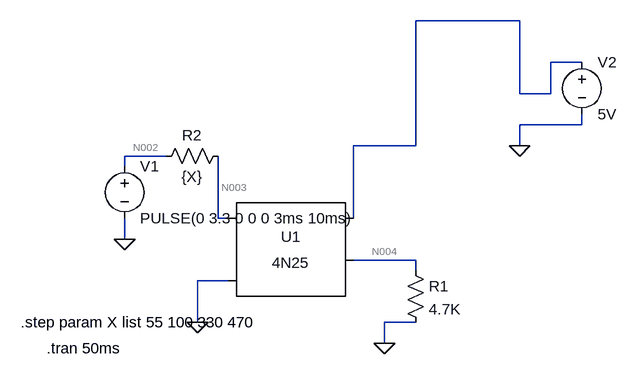
[diagram p0: schematic Draft1.asc]
Draft1.asc, the LTspice schematic file:
Version 4
SHEET 1 880 680
WIRE 512 -160 352 -160
WIRE 608 -96 560 -96
WIRE 512 -48 512 -160
WIRE 560 -48 560 -96
WIRE 560 -48 512 -48
WIRE 608 0 608 -16
WIRE 608 0 512 0
WIRE 352 32 352 -160
WIRE 352 32 256 32
WIRE 512 32 512 0
WIRE -32 48 -96 48
WIRE -96 64 -96 48
WIRE 48 144 48 48
WIRE 64 144 48 144
WIRE 256 144 256 32
WIRE -96 176 -96 144
WIRE 352 208 256 208
WIRE 352 224 352 208
WIRE 64 240 16 240
WIRE 16 304 16 240
WIRE 352 304 304 304
WIRE 304 336 304 304
FLAG -96 176 0
FLAG 512 32 0
FLAG 304 336 0
FLAG 16 304 0
SYMBOL Optos\\4N25 160 208 R0
SYMATTR InstName U1
SYMBOL voltage -96 48 R0
WINDOW 123 0 0 Left 2
WINDOW 39 0 0 Left 2
SYMATTR InstName V1
SYMATTR Value PULSE(0 3.3 0 0 0 3ms 10ms)
SYMBOL res 336 208 R0
SYMATTR InstName R1
SYMATTR Value 4.7K
SYMBOL res 64 32 R90
WINDOW 0 0 56 VBottom 2
WINDOW 3 32 56 VTop 2
SYMATTR InstName R2
SYMATTR Value {X}
SYMBOL voltage 608 -112 R0
WINDOW 123 0 0 Left 2
WINDOW 39 0 0 Left 2
SYMATTR InstName V2
SYMATTR Value 5V
TEXT -256 304 Left 2 !.step param X list 55 100 330 470
TEXT -216 344 Left 2 !.tran 50ms

The netlist it stands for:
* Draft1.asc
XU1 N003 0 N001 N004 NC_01 4N25
V1 N002 0 PULSE(0 3.3 0 0 0 3ms 10ms)
R1 N004 0 4.7K
R2 N003 N002 {X}
V2 N001 0 5V
.step param X list 55 100 330 470
.tran 50ms
.lib 4N25.sub
.backanno
.end

* Results of the author's LTspice run, read from the files saved beside the schematic
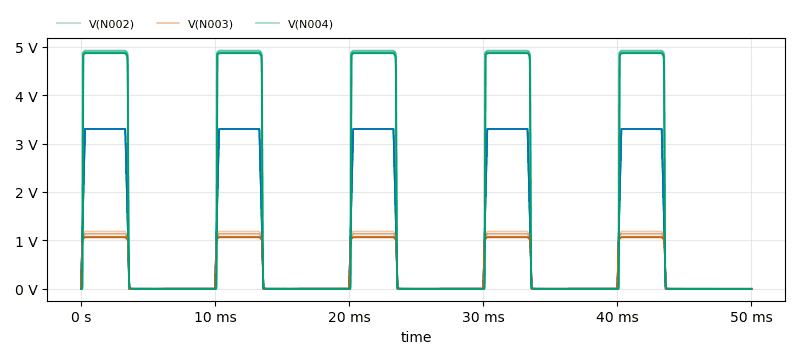
[diagram p1: Transient Analysis of Draft1.asc, plotted from the saved traces]
* Transient Analysis, 4 runs:
*   V(N002) [x=55]: min 0 V, max 3.3 V, average 1.089 V, rms 1.868 V, last 0 V
*   V(N002) [x=100]: min 0 V, max 3.3 V, average 1.089 V, rms 1.868 V, last 0 V
*   V(N002) [x=330]: min 0 V, max 3.3 V, average 1.089 V, rms 1.868 V, last 0 V
*   V(N002) [x=470]: min 0 V, max 3.3 V, average 1.089 V, rms 1.869 V, last 0 V
*   V(N003) [x=55]: min -596.6 nV, max 1.184 V, average 410.9 mV, rms 691.9 mV, last 0 V
*   V(N003) [x=100]: min -678.5 nV, max 1.135 V, average 395 mV, rms 664.9 mV, last 0 V
*   V(N003) [x=330]: min -2.912 µV, max 1.075 V, average 375.2 mV, rms 631.1 mV, last 0 V
*   V(N003) [x=470]: min -815.9 nV, max 1.062 V, average 370.8 mV, rms 623.7 mV, last 0 V
*   V(N004) [x=55]: min 0 V, max 4.924 V, average 1.687 V, rms 2.874 V, last 18.27 µV
*   V(N004) [x=100]: min 0 V, max 4.909 V, average 1.679 V, rms 2.862 V, last 18.31 µV
*   V(N004) [x=330]: min 0 V, max 4.876 V, average 1.651 V, rms 2.825 V, last 18.33 µV
*   V(N004) [x=470]: min 0 V, max 4.864 V, average 1.638 V, rms 2.809 V, last 18.16 µV